# Altium project HAB_V01R01.PrjPCB (part 2 of 2)

## Sheet [04] POWER.SchDoc
size A
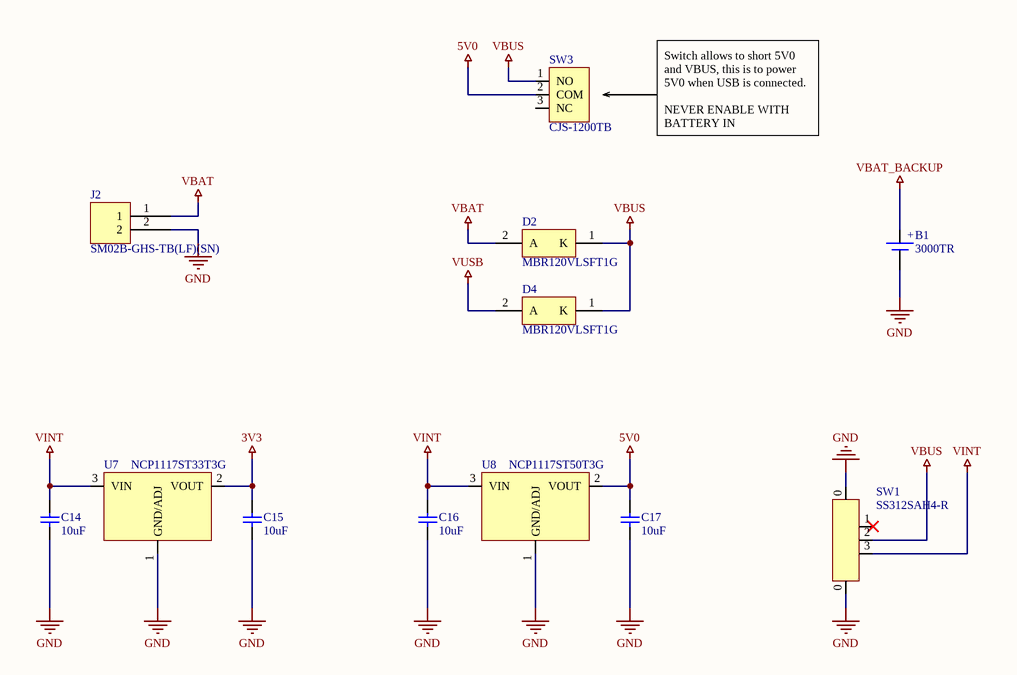
[diagram p5: [04] POWER.SchDoc]

### Parts
B1  3000TR  [3000TR]
C14  10uF  [INCH 0805 - METRIC 2012 - H140]
C15  10uF  [INCH 0805 - METRIC 2012 - H140]
C16  10uF  [INCH 0805 - METRIC 2012 - H140]
C17  10uF  [INCH 0805 - METRIC 2012 - H140]
D2  MBR120VLSFT1G  [ONSC-SOD-123FL-2-498-01_V]
D4  MBR120VLSFT1G  [ONSC-SOD-123FL-2-498-01_V]
J2  SM02B-GHS-TB(LF)(SN)  [SM02B-GHS-TB(LF)(SN)]
SW1  SS312SAH4-R  [NKK_SS312SAH4]
SW3  CJS-1200TB  [NCE_CJS-1200TB]
U7  NCP1117ST33T3G  [SOT223-4P230_700X180L90X70]
U8  NCP1117ST50T3G  [SOT223-4P230_700X180L90X70]

### Nets
3V3: C15.2 U7.2(VOUT)
5V0: C17.2 SW3.2(COM) U8.2(VOUT)
GND: B1.2(-) C14.1 C15.1 C16.1 C17.1 J2.2 SW1.0 U7.1(GND/ADJ) U8.1(GND/ADJ)
VBAT: D2.2(A) J2.1
VBAT_BACKUP: B1.1(+)
VBUS: D2.1(K) D4.1(K) SW1.2 SW3.1(NO)
VINT: C14.2 C16.2 SW1.3 U7.3(VIN) U8.3(VIN)
VUSB: D4.2(A)

Not connected (* = marked no-connect by the designer): SW1 1*; SW3 3(NC)

### Notes on the sheet
- Switch allows to short 5V0 and VBUS, this is to power 5V0 when USB is connected.
  NEVER ENABLE WITH BATTERY IN

### Library data of the parts
B1 = 3000TR: HOLDER BATTERY COIN 12MM DIA SMD; Manufacturer: Keystone Electronics; Connector Type: SMD/SMT; Number of Cells: 1; Supplier 1: Digi-Key; Manufacturer Part Number: 3000TR; RoHS: Yes; Category: Power Management ICs; Stock 1: 23941; Pricing 1: 1=0.91000, 25=0.79880, 100=0.63390, 250=0.58356, 500=0.54802 (USD); Mount: Surface Mount,PCB; Case/Package: SMD/SMT; Material: Bronze; Color: Silver; Packaging: Tape and Reel; Package Quantity: 1; Termination: SMD/SMT; Number of Batteries: 1; Diameter: 12mm; Lead Free: Lead Free; ComponentLink1URL: https://datasheet.ciiva.com/3/3000-3936.pdf?src-supplier=Digi-Key; ComponentLink1Description: https://datasheet.ciiva.com/3/3000-3936.pdf?src-supplier=Digi-Key; ComponentLink2URL: https://datasheet.ciiva.com/3/3000tr-3935.pdf?src-supplier=Digi-Key; ComponentLink2Description: https://datasheet.ciiva.com/3/3000tr-3935.pdf?src-supplier=Digi-Key; ComponentLink3URL: https://datasheet.ciiva.com/16305/m60-2p7-16305915.pdf?src-supplier=Future+Electronics; ComponentLink3Description: https://datasheet.ciiva.com/16305/m60-2p7-16305915.pdf?src-supplier=Future+Electronics; ComponentLink4URL: https://datasheet.ciiva.com/3/3000tr-3937.pdf?src-supplier=Digi-Key; ComponentLink4Description: https://datasheet.ciiva.com/3/3000tr-3937.pdf?src-supplier=Digi-Key; Supplier Part Number 1: 36-3000CT-ND
C14-C17 = GRM21BR61E106MA73L: CAP CER 10UF 25V X5R 0805; Manufacturer: Murata; Tolerance: 20%; Supplier 1: Digi-Key; Manufacturer Part Number: GRM21BR61E106MA73L; Stock 1: 30000; Pricing 1: 1=0.27, 10=0.184, 100=0.1044, 500=0.0737, 1000=0.06449 (USD); Mount: Surface Mount; Case/Package: 0805; Weight: 0.000335oz; Case Code (Metric): 2012; Case Code (Imperial): 0805; Min Operating Temperature: -55°C; Max Operating Temperature: 85°C; Capacitance: 10uF; Packaging: Tape and Reel; Dielectric: X5R; Voltage Rating: 25V; Termination: SMD/SMT; Composition: Ceramic; Voltage Rating (DC): 25V; Package Quantity: 3000; Length: 2mm; Height: 1.25mm; Width: 0.049inch; Thickness: 0.055inch; Depth: 1.25mm; REACH SVHC: No SVHC; Lead Free: Lead Free; Supplier Part Number 1: 490-10748-1-ND
D2 D4 = CMP-1055-00449-1: Schottky Power Rectifier, 2-Pin SOD-123, Pb-Free, Tape and Reel; Manufacturer: On Semiconductor; IFSM Max (A): 45; Configuration: Single; PackageDescription: 2-Pin SOD, Body 1.65 x 2.7 mm; RoHS: TRUE; ComponentLink2URL: http://www.onsemi.cn/pub_link/Collateral/MBR120VLSFT1-D.PDF; Mounting Technology: Surface Mount; ComponentLink1Description: Manufacturer URL; DatasheetVersion: Rev. 2; ComponentLink3Description: Package Specification; Packing: Tape and Reel; ComponentLink2Description: Datasheet; ComponentLink1URL: http://www.onsemi.com/; PackageVersion: Rev. A; PackageReference: SOD-123FL-2-498-01; ComponentLink3URL: http://www.onsemi.cn/pub_link/Collateral/MBR120VLSFT1-D.PDF; PartNumber: MBR120VLSFT1G
J2 = SM02B-GHS-TB(LF)(SN): Connector Header, GH Series, 2 Position, 1.25mm, 30-26 AWG, 50V, Surface Mount, Right Angle, Solder, Locking Ramp; Manufacturer: JST; Number of Positions: 2; Connector Type: Outer Shroud Contact; Current Rating: 1A; Pitch: 0.049inch; Supplier 1: Digi-Key; Manufacturer Part Number: SM02B-GHS-TB(LF)(SN); RoHS: Yes; Category: Headers and Wire Housings; Stock 1: 14162; Pricing 1: 1=0.46000, 10=0.43800, 100=0.30670, 500=0.26292, 1000=0.21910 (USD); Mount: Surface Mount; Housing Material: Nylon; Color: Natural; Contact Material: Bronze; Housing Color: Natural; Contact Plating: Tin; Number of Rows: 1; Fastening Type: Ramp; Packaging: Tape and Reel; Termination: Solder; Number of Contacts: 2; Voltage Rating: 50V; Orientation: Right Angle; Lead Free: Lead Free; ComponentLink1URL: https://datasheet.ciiva.com/25617/0900766b810cef17-25617252.pdf?src-supplier=RSComponents; ComponentLink1Description: https://datasheet.ciiva.com/25617/0900766b810cef17-25617252.pdf?src-supplier=RSComponents; ComponentLink2URL: https://datasheet.ciiva.com/730/egh-730691.pdf?src-supplier=Digi-Key; ComponentLink2Description: https://datasheet.ciiva.com/730/egh-730691.pdf?src-supplier=Digi-Key; ComponentLink3URL: https://datasheet.ciiva.com/712/egh-712452.pdf?src-supplier=Digi-Key; ComponentLink3Description: https://datasheet.ciiva.com/712/egh-712452.pdf?src-supplier=Digi-Key; ComponentLink4URL: https://datasheet.ciiva.com/16345/jstsm02b-ghs-tb-lf-sn-16345351.pdf?src-supplier=Future+Electronics; ComponentLink4Description: https://datasheet.ciiva.com/16345/jstsm02b-ghs-tb-lf-sn-16345351.pdf?src-supplier=Future+Electronics; Supplier Part Number 1: 455-1564-1-ND
SW1 = SS312SAH4-R: SWITCH SLIDE SPDT 0.4VA 28V; Manufacturer: NKK Switches; Actuator Material: Polyphenylene; Mechanical Life: 10000Cycles; Max Current Rating: 100mA; Switch Travel: 2mm; Switch Function: On-On; Actuator Type: Standard; Supplier 1: Digi-Key; Manufacturer Part Number: SS312SAH4-R; RoHS: Yes; Stock 1: 6697; Pricing 1: 1 = 3.33000, 10 = 3.18800, 25 = 3.04920, 50 = 2.70280, 100 = 2.63340, 250 = 2.59876 (USD); Mount: Surface Mount; Case/Package: SMD/SMT; Contact Material: Bronze; Contact Plating: Gold,Silver; Housing Material: Bronze; Min Operating Temperature: -25°C; Max Operating Temperature: 85°C; Packaging: Tape and Reel; Package Quantity: 500; Throw Configuration: SPDT; Voltage Rating (AC): 28V; Max Voltage Rating (AC): 28V; Max Voltage Rating (DC): 28V; Termination: Gull Wing; Voltage Rating (DC): 28V; Electrical Life: 10000Cycles; Orientation: Right Angle; Length: 10.5mm; Depth: 7.45mm; Actuator Length: 2mm; Lead Free: Lead Free; REACH SVHC: No SVHC; ComponentLink1URL: http://www.farnell.com/datasheets/1783587.pdf?src-supplier=Element14; ComponentLink1Description: http://www.farnell.com/datasheets/1783587.pdf?src-supplier=Element14; Supplier Part Number 1: 360-2924-1-ND
SW3 = CJS-1200TB: SWITCH SLIDE SPDT 100MA 6V; Manufacturer: Nidec Copal; Body Material: Polyphenylene; Max Voltage Rating (DC): 24V; Number of Positions: 2; Electrical Life: 200Cycles; Washable: Yes; Supplier 1: Digi-Key; Manufacturer Part Number: CJS-1200TB; Stock 1: 0; Mount: Surface Mount; Contact Material: Copper Alloy; Contact Plating: Gold; Min Operating Temperature: -40°C; Max Operating Temperature: 85°C; Throw Configuration: SPDT; Packaging: Tape and Reel; Termination: Gull Wing; Voltage Rating (DC): 6V; Current Rating: 100mA; Orientation: Vertical; Length: 0.212inch; Radiation Hardening: No; Lead Free: Lead Free; ComponentLink1URL: https://datasheet.ciiva.com/2865/cjs-2865057.pdf; ComponentLink1Description: https://datasheet.ciiva.com/2865/cjs-2865057.pdf; ComponentLink2URL: https://datasheet.ciiva.com/2865/cjs-2865058.pdf; ComponentLink2Description: https://datasheet.ciiva.com/2865/cjs-2865058.pdf; ComponentLink3URL: https://datasheet.ciiva.com/2865/cjs-2865059.pdf; ComponentLink3Description: https://datasheet.ciiva.com/2865/cjs-2865059.pdf; Supplier Part Number 1: 563-1022-1-ND
U7 = NCP1117ST33T3G: IC REG LINEAR 3.3V 1A SOT223; Manufacturer: ON Semiconductor; Max Input Voltage: 20V; Number of Outputs: 1; Dropout Voltage: 1.07V; Max Supply Voltage: 15V; Min Supply Voltage: 4.75V; Min Input Voltage: 3.5V; Input Bias Current: 6mA; Quiescent Current: 10mA; Polarity: Positive; Reference Voltage: 1.25V; Accuracy: 1%; Output Type: Fixed; Supplier 1: Digi-Key; Manufacturer Part Number: NCP1117ST33T3G; RoHS: Yes; Stock 1: 60671; Pricing 1: 1 = 0.52000, 10 = 0.44400, 100 = 0.33150, 500 = 0.26048, 1000 = 0.20129 (USD); Mount: Surface Mount; Case/Package: SOT-223; Number of Pins: 3; Contact Plating: Tin; Min Operating Temperature: 0°C; Max Operating Temperature: 125°C; Output Voltage: 3.3V; Packaging: Tape and Reel; Output Current: 1A; Max Output Current: 1A; Package Quantity: 1; Nominal Output Voltage: 3.3V; Number of Regulators: 1; Min Current Limit: 1A; Min Output Voltage: 3.3V; Max Output Voltage: 3.3V; Termination: SMD/SMT; Output Voltage Accuracy: 1%; Length: 6.7mm; Height: 1.69mm; Width: 3.7mm; Radiation Hardening: No; REACH SVHC: No SVHC; Lead Free: Lead Free; Halogen Free: Halogen Free; ComponentLink1URL: https://datasheet.ciiva.com/3224/ncp1117-d-3224144.pdf?src-supplier=Avnet; ComponentLink1Description: https://datasheet.ciiva.com/3224/ncp1117-d-3224144.pdf?src-supplier=Avnet; ComponentLink2URL: https://datasheet.ciiva.com/22697/1726422-22697602.pdf?src-supplier=Element14; ComponentLink2Description: https://datasheet.ciiva.com/22697/1726422-22697602.pdf?src-supplier=Element14; ComponentLink3URL: https://datasheet.ciiva.com/15111/getdatasheetpartid-82718-15111483.pdf?src-supplier=Verical; ComponentLink3Description: https://datasheet.ciiva.com/15111/getdatasheetpartid-82718-15111483.pdf?src-supplier=Verical; ComponentLink4URL: https://datasheet.ciiva.com/8233/ncp1117-d-8233589.pdf?src-supplier=Avnet; ComponentLink4Description: https://datasheet.ciiva.com/8233/ncp1117-d-8233589.pdf?src-supplier=Avnet; ComponentLink5URL: https://datasheet.ciiva.com/2042/ncp1117-d-2042027.pdf?src-supplier=Digi-Key; ComponentLink5Description: https://datasheet.ciiva.com/2042/ncp1117-d-2042027.pdf?src-supplier=Digi-Key; ComponentLink6URL: https://datasheet.ciiva.com/2042/ncp1117-d-2042028.pdf?src-supplier=Digi-Key; ComponentLink6Description: https://datasheet.ciiva.com/2042/ncp1117-d-2042028.pdf?src-supplier=Digi-Key; ComponentLink7URL: https://datasheet.ciiva.com/2042/ncp1117-d-2042029.pdf?src-supplier=Digi-Key; ComponentLink7Description: https://datasheet.ciiva.com/2042/ncp1117-d-2042029.pdf?src-supplier=Digi-Key; ComponentLink8URL: https://datasheet.ciiva.com/8073/1726422-8073735.pdf?src-supplier=Element14; ComponentLink8Description: https://datasheet.ciiva.com/8073/1726422-8073735.pdf?src-supplier=Element14; ComponentLink9URL: https://datasheet.ciiva.com/28483/1748260-28483307.pdf?src-supplier=Element14; ComponentLink9Description: https://datasheet.ciiva.com/28483/1748260-28483307.pdf?src-supplier=Element14; ComponentLink10URL: https://datasheet.ciiva.com/16382/ncp1117-d-16382636.pdf?src-supplier=Future+Electronics; ComponentLink10Description: https://datasheet.ciiva.com/16382/ncp1117-d-16382636.pdf?src-supplier=Future+Electronics; Supplier Part Number 1: NCP1117ST33T3GOSCT-ND
U8 = NCP1117ST50T3G: IC REG LINEAR 5V 1A SOT223; Manufacturer: ON Semiconductor; Number of Outputs: 1; Max Input Voltage: 20V; Min Input Voltage: 3.5V; Dropout Voltage: 1.2V; Input Bias Current: 6mA; Polarity: Positive; Quiescent Current: 10mA; Output Voltage Accuracy: 1%; Power Rating: 781mW; Output Type: Fixed; Supplier 1: Digi-Key; Manufacturer Part Number: NCP1117ST50T3G; RoHS: Yes; Stock 1: 20727; Pricing 1: 1 = 0.54000, 10 = 0.45800, 100 = 0.34230, 500 = 0.26896, 1000 = 0.20783 (USD); Case/Package: SOT-223; Number of Pins: 4; Contact Plating: Tin; Min Operating Temperature: 0°C; Max Operating Temperature: 125°C; Package Quantity: 1; Output Voltage: 5V; Output Current: 1A; Max Output Current: 1A; Nominal Output Voltage: 5V; Packaging: Tape and Reel; Number of Regulators: 1; Min Current Limit: 1A; Accuracy: 1%; Tolerance: 1%; Length: 6.7mm; Height: 1.69mm; Width: 3.7mm; Radiation Hardening: No; REACH SVHC: No SVHC; Lead Free: Lead Free; Halogen Free: Halogen Free; ComponentLink1URL: https://datasheet.ciiva.com/28483/1748260-28483320.pdf?src-supplier=Element14; ComponentLink1Description: https://datasheet.ciiva.com/28483/1748260-28483320.pdf?src-supplier=Element14; ComponentLink2URL: https://datasheet.ciiva.com/2042/ncp1117-d-2042018.pdf?src-supplier=Digi-Key; ComponentLink2Description: https://datasheet.ciiva.com/2042/ncp1117-d-2042018.pdf?src-supplier=Digi-Key; ComponentLink3URL: https://datasheet.ciiva.com/2042/ncp1117-d-2042019.pdf?src-supplier=Digi-Key; ComponentLink3Description: https://datasheet.ciiva.com/2042/ncp1117-d-2042019.pdf?src-supplier=Digi-Key; ComponentLink4URL: https://datasheet.ciiva.com/2042/ncp1117-d-2042020.pdf?src-supplier=Digi-Key; ComponentLink4Description: https://datasheet.ciiva.com/2042/ncp1117-d-2042020.pdf?src-supplier=Digi-Key; ComponentLink5URL: https://datasheet.ciiva.com/25978/ncp1117-d-25978293.pdf?src-supplier=Avnet+Europe; ComponentLink5Description: https://datasheet.ciiva.com/25978/ncp1117-d-25978293.pdf?src-supplier=Avnet+Europe; ComponentLink6URL: https://datasheet.ciiva.com/16491/ncp1117-d-16491895.pdf?src-supplier=Avnet+Asia; ComponentLink6Description: https://datasheet.ciiva.com/16491/ncp1117-d-16491895.pdf?src-supplier=Avnet+Asia; ComponentLink7URL: https://datasheet.ciiva.com/8073/ncp1117-d-8073736.pdf?src-supplier=Element14; ComponentLink7Description: https://datasheet.ciiva.com/8073/ncp1117-d-8073736.pdf?src-supplier=Element14; ComponentLink8URL: https://datasheet.ciiva.com/8233/ncp1117-d-8233593.pdf?src-supplier=Avnet; ComponentLink8Description: https://datasheet.ciiva.com/8233/ncp1117-d-8233593.pdf?src-supplier=Avnet; ComponentLink9URL: https://datasheet.ciiva.com/16209/ncp1117-d-16209561.pdf?src-supplier=Future+Electronics; ComponentLink9Description: https://datasheet.ciiva.com/16209/ncp1117-d-16209561.pdf?src-supplier=Future+Electronics; ComponentLink10URL: https://datasheet.ciiva.com/8231/ncp1117-d-8231068.pdf?src-supplier=Avnet; ComponentLink10Description: https://datasheet.ciiva.com/8231/ncp1117-d-8231068.pdf?src-supplier=Avnet; ComponentLink11URL: https://datasheet.ciiva.com/8073/ncp1117-d-8073902.pdf?src-supplier=Element14; ComponentLink11Description: https://datasheet.ciiva.com/8073/ncp1117-d-8073902.pdf?src-supplier=Element14; Supplier Part Number 1: NCP1117ST50T3GOSCT-ND

## Sheet [05] SENSORS.SchDoc
size A
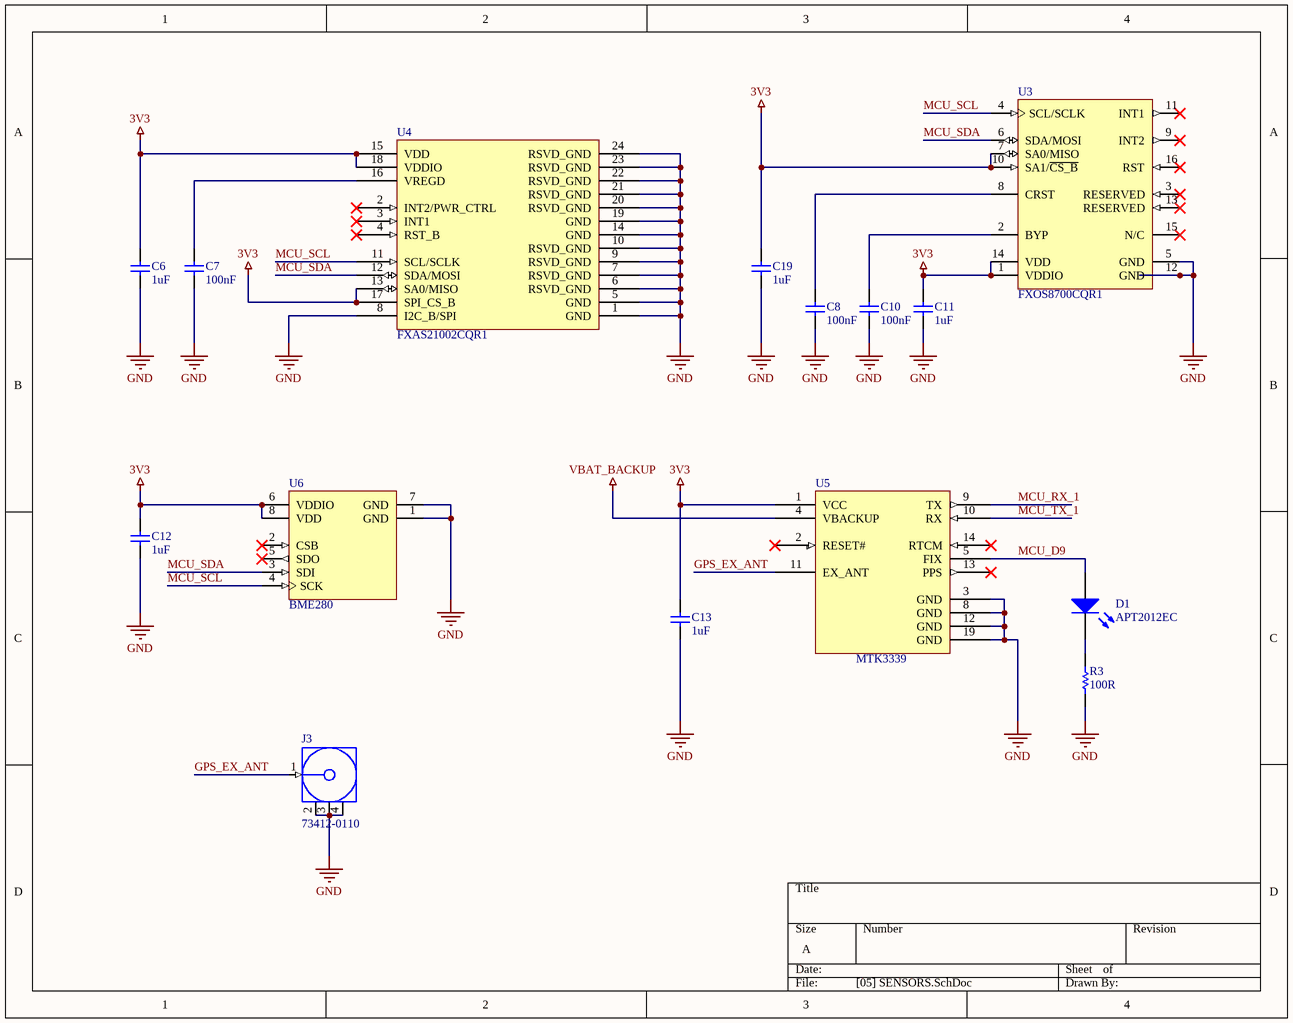
[diagram p6: [05] SENSORS.SchDoc]

### Parts
C6  1uF  [INCH 0805 - METRIC 2012 - H140]
C7  100nF  [INCH 0805 - METRIC 2012 - H120]
C8  100nF  [INCH 0805 - METRIC 2012 - H120]
C10  100nF  [INCH 0805 - METRIC 2012 - H120]
C11  1uF  [INCH 0805 - METRIC 2012 - H140]
C12  1uF  [INCH 0805 - METRIC 2012 - H140]
C13  1uF  [INCH 0805 - METRIC 2012 - H140]
C19  1uF  [INCH 0805 - METRIC 2012 - H140]
D1  APT2012EC  [LED - 0805 - GREEN]
J3  73412-0110  [MOLX-73412-0110_V]
R3  100R  [INCH 0805 - METRIC 2012 - H070]
U3  FXOS8700CQR1  [FREE-QFN-16-3000X3000DE_V]
U4  FXAS21002CQR1  [FXAS21002CQR1]
U5  MTK3339  [MTK3339]
U6  BME280  [BOSC-BME280-8_V]

### Nets
3V3: C6.2 C11.2 C12.2 C13.2 C19.2 U3.1(VDDIO) U3.7(SA0/MISO) U3.10(SA1/~{CS_B}) U3.14(VDD) U4.13(SA0/MISO) U4.15(VDD) U4.17(SPI_CS_B) U4.18(VDDIO) U5.1(VCC) U6.6(VDDIO) U6.8(VDD)
GND: C6.1 C7.1 C8.1 C10.1 C11.1 C12.1 C13.1 C19.1 J3.2(GND) J3.3(GND) J3.4(GND) R3.1 U3.5(GND) U3.12(GND) U4.1(GND) U4.5(GND) U4.6(RSVD_GND) U4.7(RSVD_GND) U4.8(I2C_B/SPI) U4.9(RSVD_GND) U4.10(RSVD_GND) U4.14(GND) U4.19(GND) U4.20(RSVD_GND) U4.21(RSVD_GND) U4.22(RSVD_GND) U4.23(RSVD_GND) U4.24(RSVD_GND) U5.3(GND) U5.8(GND) U5.12(GND) U5.19(GND) U6.1(GND) U6.7(GND)
VBAT_BACKUP: U5.4(VBACKUP)
GPS_EX_ANT: J3.1(SIGNAL) U5.11(EX_ANT)
MCU_D9: D1.A U5.5(FIX)
MCU_RX_1: U5.9(TX)
MCU_SCL: U3.4(SCL/SCLK) U4.11(SCL/SCLK) U6.4(SCK)
MCU_SDA: U3.6(SDA/MOSI) U4.12(SDA/MOSI) U6.3(SDI)
MCU_TX_1: U5.10(RX)
NetC7_2: C7.2 U4.16(VREGD)
NetC8_2: C8.2 U3.8(CRST)
NetC10_2: C10.2 U3.2(BYP)
NetD1_C: D1.C R3.2

Not connected (* = marked no-connect by the designer): U3 3(RESERVED)* 9(INT2)* 11(INT1)* 13(RESERVED)* 15(N/C)* 16(RST)*; U4 2(INT2/PWR_CTRL)* 3(INT1)* 4(RST_B)*; U5 2(RESET#)* 13(PPS)* 14(RTCM)*; U6 2(CSB)* 5(SDO)*

### Library data of the parts
C6 C11-C13 C19 = GCM21BR71E105KA56L: CAP SMD 1uF 25V 10% 0805; Manufacturer: Murata; Dielectric: X7R; Supplier 1: Digi-Key; Manufacturer Part Number: GCM21BR71E105KA56L; RoHS: Yes; Category: Ceramic Capacitors; Stock 1: 1572955; Pricing 1: 1=0.33000, 10=0.22500, 100=0.12760, 500=0.09004, 1000=0.07878 (USD); Mount: Surface Mount; Case/Package: 0805; Case Code (Metric): 2012; Case Code (Imperial): 0805; Min Operating Temperature: -55°C; Max Operating Temperature: 125°C; Termination: SMD/SMT; Voltage: 25V; Package Quantity: 3000; Capacitance: 1uF; Voltage Rating: 25V; Tolerance: 10%; Packaging: Tape and Reel; Voltage Rating (DC): 25V; Length: 2mm; Height: 1.25mm; Thickness: 0.055inch; Depth: 1.25mm; Width: 0.049inch; Ratings: AEC-Q200; Radiation Hardening: No; REACH SVHC: No SVHC; Lead Free: Lead Free; ComponentLink1URL: https://datasheet.ciiva.com/3778/359gcm21br71e105ka5623-3778560.pdf?src-supplier=Arrow; ComponentLink1Description: https://datasheet.ciiva.com/3778/359gcm21br71e105ka5623-3778560.pdf?src-supplier=Arrow; ComponentLink2URL: https://datasheet.ciiva.com/16624/product-16624576.pdf?src-supplier=Avnet+Europe; ComponentLink2Description: https://datasheet.ciiva.com/16624/product-16624576.pdf?src-supplier=Avnet+Europe; ComponentLink3URL: https://datasheet.ciiva.com/18183/getdatasheetpartid-153106-18183696.pdf?src-supplier=Verical; ComponentLink3Description: https://datasheet.ciiva.com/18183/getdatasheetpartid-153106-18183696.pdf?src-supplier=Verical; ComponentLink4URL: https://datasheet.ciiva.com/11789/0900766b80ef92d0-11789092.pdf?src-supplier=RSComponents; ComponentLink4Description: https://datasheet.ciiva.com/11789/0900766b80ef92d0-11789092.pdf?src-supplier=RSComponents; ComponentLink5URL: https://datasheet.ciiva.com/137/product-137199.pdf?src-supplier=Digi-Key; ComponentLink5Description: https://datasheet.ciiva.com/137/product-137199.pdf?src-supplier=Digi-Key; ComponentLink6URL: https://datasheet.ciiva.com/137/product-137200.pdf?src-supplier=Digi-Key; ComponentLink6Description: https://datasheet.ciiva.com/137/product-137200.pdf?src-supplier=Digi-Key; ComponentLink7URL: https://datasheet.ciiva.com/137/product-137201.pdf?src-supplier=Digi-Key; ComponentLink7Description: https://datasheet.ciiva.com/137/product-137201.pdf?src-supplier=Digi-Key; ComponentLink8URL: https://datasheet.ciiva.com/2989/product-2989245.pdf?src-supplier=Avnet; ComponentLink8Description: https://datasheet.ciiva.com/2989/product-2989245.pdf?src-supplier=Avnet; ComponentLink9URL: https://datasheet.ciiva.com/2989/product-2989246.pdf?src-supplier=Avnet; ComponentLink9Description: https://datasheet.ciiva.com/2989/product-2989246.pdf?src-supplier=Avnet; Supplier Part Number 1: 490-4785-1-ND
C7 C8 C10 = C0805C104K1RACTU: CAP CER 0.1UF 100V X7R 0805; Manufacturer: KEMET; Dielectric Material: Ceramic; Tolerance: 10%; Dissipation Factor: 2.5%; Supplier 1: Digi-Key; Manufacturer Part Number: C0805C104K1RACTU; Stock 1: 25000; Pricing 1: 1=0.33, 10=0.226, 100=0.1147, 500=0.07848, 1000=0.06943 (USD); Mount: Surface Mount,PCB; Case/Package: 0805; Number of Pins: 2; Case Code (Imperial): 0805; Case Code (Metric): 2012; Contact Plating: Tin,Matte; Min Operating Temperature: -55°C; Max Operating Temperature: 125°C; Capacitance: 100nF; Voltage Rating: 100V; Packaging: Tape and Reel; Package Quantity: 1; Voltage Rating (DC): 100V; Dielectric: X7R; Termination: SMD/SMT; Voltage: 100V; Length: 2mm; Height: 1mm; Width: 1.2mm; Lead Pitch: 0.75mm; Thickness: 0.043inch; Depth: 1.25mm; Radiation Hardening: No; REACH SVHC: No SVHC; ComponentLink1URL: https://datasheet.ciiva.com/7842/1776102-7842535.pdf; ComponentLink1Description: https://datasheet.ciiva.com/7842/1776102-7842535.pdf; ComponentLink2URL: https://datasheet.ciiva.com/14589/70095383-14589479.pdf; ComponentLink2Description: https://datasheet.ciiva.com/14589/70095383-14589479.pdf; ComponentLink3URL: https://datasheet.ciiva.com/5411/kem-c1002-x7r-smd-5411498.pdf; ComponentLink3Description: https://datasheet.ciiva.com/5411/kem-c1002-x7r-smd-5411498.pdf; Supplier Part Number 1: 399-3486-1-ND; Category: Capacitor
D1 = APT2012EC: LED RED CLEAR CHIP SMD; Manufacturer: Kingbright; Power Rating: 75mW; Luminous Intensity: 12mcd; Viewing Angle: 120°; Lens Style: Clear,Flat; Number of LEDs: 1; Wavelength: 625nm; Test Current: 20mA; Forward Voltage: 2V; Supplier 1: Digi-Key; Manufacturer Part Number: APT2012EC; RoHS: Yes; Category: LEDs; Stock 1: 35644; Pricing 1: 1=0.35000, 10=0.25700, 100=0.12150, 500=0.08100, 1000=0.06345 (USD); Mount: Surface Mount; Case/Package: 0805; Number of Pins: 2; Case Code (Metric): 2012; Color: Red; Case Code (Imperial): 0805; Lens Color: Clear; Min Operating Temperature: -40°C; Max Operating Temperature: 85°C; Packaging: Tape and Reel; Package Quantity: 1; Dominant Wavelength: 625nm; Illumination Color: Red; Forward Current: 20mA; Length: 2mm; Height: 0.75mm; Width: 1.25mm; Lead Free: Lead Free; ComponentLink1URL: https://datasheet.ciiva.com/2113/apt2012ec-2113812.pdf?src-supplier=Digi-Key; ComponentLink1Description: https://datasheet.ciiva.com/2113/apt2012ec-2113812.pdf?src-supplier=Digi-Key; ComponentLink2URL: https://datasheet.ciiva.com/4688/apt2012ec-35230-4688685.pdf?src-supplier=Mouser; ComponentLink2Description: https://datasheet.ciiva.com/4688/apt2012ec-35230-4688685.pdf?src-supplier=Mouser; ComponentLink3URL: https://datasheet.ciiva.com/2113/apt2012ec-2113813.pdf?src-supplier=Digi-Key; ComponentLink3Description: https://datasheet.ciiva.com/2113/apt2012ec-2113813.pdf?src-supplier=Digi-Key; ComponentLink4URL: https://datasheet.ciiva.com/2113/apt2012ec-2113814.pdf?src-supplier=Digi-Key; ComponentLink4Description: https://datasheet.ciiva.com/2113/apt2012ec-2113814.pdf?src-supplier=Digi-Key; Supplier Part Number 1: 754-1128-1-ND
J3 = CMP-1676-00003-1: MCRF, PCB Vertical Jack Receptacle, 50 Ohm, 4-Pin SMD, RoHS, Tape and Reel; Voltage Rating (AC): 60 V; Mating Cycles: 30; Impedance: 50 Ohm; Frequency: 6 Hz; Gender: Female; RoHSCompliant: true; Length: 3 mm; DatasheetVersion: 04/2016; ComponentLink3URL: http://www.molex.com/pdm_docs/sd/734120110_sd.pdf; Max Operating Temperature: 90 degC; Contact Material: Bronze; Mount: Surface Mount; ComponentLink2Description: Datasheet; Packaging: Tape and Reel; Radiation Hardening: No; Voltage Rating: 60 V; Mounting Technology: Surface Mount; ComponentLink1Description: Manufacturer URL; ComponentLink1URL: http://www.molex.com/; Width: 3 mm; ComponentLink3Description: Package Specification; Package Quantity: 5000; PackageReference: 73412-0110; Min Operating Temperature: -40 degC; Height: 1.25 mm; REACH SVHC: Unknown; ComponentLink2URL: http://www.molex.com/webdocs/datasheets/pdf/en-us/0734120110_RF_COAX_CONNECTORS.pdf; Contact Plating: Gold; PackageDescription: 4-Leads SMD, Body 2.6 x 2.6 mm; PackageVersion: Rev. C14, 07/2015
R3 = ERJ-P06J101V: RES SMD 100 OHM 5% 1/2W 0805; Manufacturer: Panasonic; Temperature Coefficient: 200ppm/°C; Power Rating: 500mW; Voltage Rating: 400V; Voltage Rating (DC): 150V; Supplier 1: Digi-Key; Manufacturer Part Number: ERJ-P06J101V; RoHS: Yes; Category: Chip SMD Resistors; Stock 1: 141947; Pricing 1: 1=0.11000, 10=0.10300, 100=0.03960, 1000=0.01742, 2500=0.01505 (USD); Mount: Surface Mount; Case/Package: 0805; Weight: 0.000194oz; Contact Plating: Tin; Case Code (Imperial): 0805; Case Code (Metric): 2012; Min Operating Temperature: -55°C; Max Operating Temperature: 155°C; Resistance: 100R; Tolerance: 5%; Composition: Thick Film; Packaging: Tape and Reel; Package Quantity: 1; Max Power Dissipation: 500mW; Number of Terminations: 2; Military Standard: Not; Termination: SMD/SMT; Features: Automotive AEC-Q200; Length: 2mm; Height: 0.6mm; Width: 1.2mm; Depth: 1.25mm; Lead Free: Lead Free; REACH SVHC: Unknown; ComponentLink1URL: https://datasheet.ciiva.com/11810/0900766b812cb812-11810156.pdf?src-supplier=RSComponents; ComponentLink1Description: https://datasheet.ciiva.com/11810/0900766b812cb812-11810156.pdf?src-supplier=RSComponents; ComponentLink2URL: https://datasheet.ciiva.com/16788/70068906-16788678.pdf?src-supplier=Allied+Electronics; ComponentLink2Description: https://datasheet.ciiva.com/16788/70068906-16788678.pdf?src-supplier=Allied+Electronics; ComponentLink3URL: https://datasheet.ciiva.com/7831/aoa0000ce4-7831000.pdf?src-supplier=Element14; ComponentLink3Description: https://datasheet.ciiva.com/7831/aoa0000ce4-7831000.pdf?src-supplier=Element14; ComponentLink4URL: https://datasheet.ciiva.com/16767/70068906-16767564.pdf?src-supplier=Allied+Electronics; ComponentLink4Description: https://datasheet.ciiva.com/16767/70068906-16767564.pdf?src-supplier=Allied+Electronics; ComponentLink5URL: https://datasheet.ciiva.com/9186/aoa0000ce4-9186844.pdf?src-supplier=Avnet; ComponentLink5Description: https://datasheet.ciiva.com/9186/aoa0000ce4-9186844.pdf?src-supplier=Avnet; ComponentLink6URL: https://datasheet.ciiva.com/24163/aoa0000ce4-64075-24163318.pdf?src-supplier=Mouser; ComponentLink6Description: https://datasheet.ciiva.com/24163/aoa0000ce4-64075-24163318.pdf?src-supplier=Mouser; ComponentLink7URL: https://datasheet.ciiva.com/17208/aoa0000ce4-17208010.pdf?src-supplier=Avnet+Europe; ComponentLink7Description: https://datasheet.ciiva.com/17208/aoa0000ce4-17208010.pdf?src-supplier=Avnet+Europe; Supplier Part Number 1: P100ADCT-ND
U3 = CMP-2000-05129-1: 6-Axis Xtrinsic Sensor with Integrated Linear Accelerometer and Magnetometer, 1.95 to 3.6 V, -40 to 85 degC, 16-Pin QFN, RoHS, Tape and Reel; Manufacturer: Freescale; Supply Voltage - Min: 1.95V; Operating Supply Voltage: 1.95Vto3.6V; Unit Weight: 0.000808oz; Supply Voltage - Max: 3.6V; Brand: FreescaleSemiconductor; Sensing Axis: X,Y,Z; Output Type: Digital; Package / Case: QFN-16; Datasheet Version: Rev. 1, 06/2012; Factory Pack Quantity: 1000; Mounting Style: SMD/SMT; Datasheet URL: https://datasheet.ciiva.com/12175/fxos8700cq-60595-12175213.pdf; Type: 6AxisSensor; Maximum Operating Temperature: +85C; Manufacturer URL: http://www.nxp.com/; Package Description: 16-Pin Quad Flat No-lead Package, Body 3 x 3 mm, Pitch 0.5 mm; RoHS: Details; Package Reference: QFN-16; Tradename: Xtrinsic; Packaging: Reel; Minimum Operating Temperature: -40C; Product Category: BoardMountAccelerationSensors
U4 = FXAS21002CQR1: NXP Precision 3 Axis Gyro I2C; Supplier 1: Digi-Key; Supplier Part Number 1: FXAS21002CQR1CT-ND
U5 = MTK3339: Ultimate GPS Module 66 channel 10 Hz
U6 = CMP-2000-05073-1: Combined Humidity and Pressure Sensor, 1.71 to 3.6 V, -40 to 85 degC, 8-Pin SMD, RoHS, Tape and Reel; Manufacturer: Bosch Sensortec; Datasheet Version: Rev. 1.2, 10/2015; Datasheet URL: http://datasheet.octopart.com/BME280-Bosch-datasheet-58577763.pdf; Manufacturer URL: http://www.bosch-sensortec.com

## Sheet [06] Connectors.SchDoc
size A
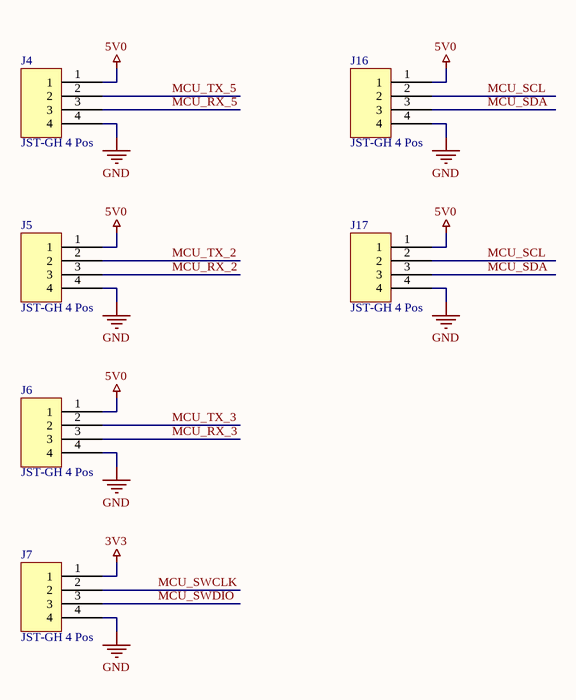
[diagram p7: [06] Connectors.SchDoc]

### Parts
J4  JST-GH 4 Pos  [SM04B-GHS-TB(LF)(SN)-]
J5  JST-GH 4 Pos  [SM04B-GHS-TB(LF)(SN)-]
J6  JST-GH 4 Pos  [SM04B-GHS-TB(LF)(SN)-]
J7  JST-GH 4 Pos  [SM04B-GHS-TB(LF)(SN)-]
J16  JST-GH 4 Pos  [SM04B-GHS-TB(LF)(SN)-]
J17  JST-GH 4 Pos  [SM04B-GHS-TB(LF)(SN)-]

### Nets
3V3: J7.1
5V0: J4.1 J5.1 J6.1 J16.1 J17.1
GND: J4.4 J5.4 J6.4 J7.4 J16.4 J17.4
MCU_RX_2: J5.3
MCU_RX_3: J6.3
MCU_RX_5: J4.3
MCU_SCL: J16.2 J17.2
MCU_SDA: J16.3 J17.3
MCU_SWCLK: J7.2
MCU_SWDIO: J7.3
MCU_TX_2: J5.2
MCU_TX_3: J6.2
MCU_TX_5: J4.2

### Library data of the parts
J4-J7 J16 J17 = SM04B-GHS-TB(LF)(SN)-: JST-GH CONN HEADER SMD R/A 4 POS 1.25MM; Manufacturer: JST; Connector Type: Outer Shroud Contact; Number of Positions: 4; Pitch: 0.049inch; Supplier 1: Digi-Key; Manufacturer Part Number: SM04B-GHS-TB(LF)(SN)-; RoHS: Yes; Category: Connectors; Stock 1: 34258; Pricing 1: 1=0.45000, 10=0.42300, 100=0.32440, 500=0.28212, 1000=0.23274 (USD); Mount: Surface Mount; Color: Natural; Contact Plating: Tin; Number of Rows: 1; Fastening Type: Ramp; Packaging: Cut Tape; Termination: Solder; ComponentLink1URL: https://datasheet.ciiva.com/6832/egh-6832463.pdf?src-supplier=Digi-Key; ComponentLink1Description: https://datasheet.ciiva.com/6832/egh-6832463.pdf?src-supplier=Digi-Key; Supplier Part Number 1: 455-1566-1-ND

## Nets that join several sheets
3V3: [02] - HAB (13 pins), [03] PWM DRIVER (C18.2 U9.28), [04] POWER (C15.2 U7.2), [05] SENSORS (16 pins), [06] Connectors (J7.1)
5V0: [02] - HAB (D3.4 D3.5 D3.6 LS1.1), [03] PWM DRIVER (J8.2 J9.2 J10.2 J11.2), [04] POWER (C17.2 SW3.2 U8.2), [06] Connectors (5 pins)
GND: [02] - HAB (29 pins), [03] PWM DRIVER (8 pins), [04] POWER (9 pins), [05] SENSORS (34 pins), [06] Connectors (6 pins)
VBAT_BACKUP: [02] - HAB (U2.3), [04] POWER (B1.1), [05] SENSORS (U5.4)
VUSB: [02] - HAB (J1.1), [04] POWER (D4.2)
MCU_D9: [02] - HAB (U1.12), [05] SENSORS (D1.A U5.5)
MCU_RX_1: [02] - HAB (U1.16), [05] SENSORS (U5.9)
MCU_RX_2: [02] - HAB (U1.25), [06] Connectors (J5.3)
MCU_RX_3: [02] - HAB (U1.14), [06] Connectors (J6.3)
MCU_RX_5: [02] - HAB (U1.38), [06] Connectors (J4.3)
MCU_SCL: [02] - HAB (R2.1 U1.32 U2.6), [03] PWM DRIVER (U9.26), [05] SENSORS (U3.4 U4.11 U6.4), [06] Connectors (J16.2 J17.2)
MCU_SDA: [02] - HAB (R1.1 U1.31 U2.5), [03] PWM DRIVER (U9.27), [05] SENSORS (U3.6 U4.12 U6.3), [06] Connectors (J16.3 J17.3)
MCU_SWCLK: [02] - HAB (U1.45), [06] Connectors (J7.2)
MCU_SWDIO: [02] - HAB (U1.46), [06] Connectors (J7.3)
MCU_TX_1: [02] - HAB (U1.15), [05] SENSORS (U5.10)
MCU_TX_2: [02] - HAB (U1.27), [06] Connectors (J5.2)
MCU_TX_3: [02] - HAB (U1.13), [06] Connectors (J6.2)
MCU_TX_5: [02] - HAB (U1.37), [06] Connectors (J4.2)

## Assembly variants
ORIGINAL: not fitted Q2 R36 R36 R37 R58 R60 R62 R95 R96 R97 R?